# EAGLE design hw-demo02 (EAGLE 7.3.0)
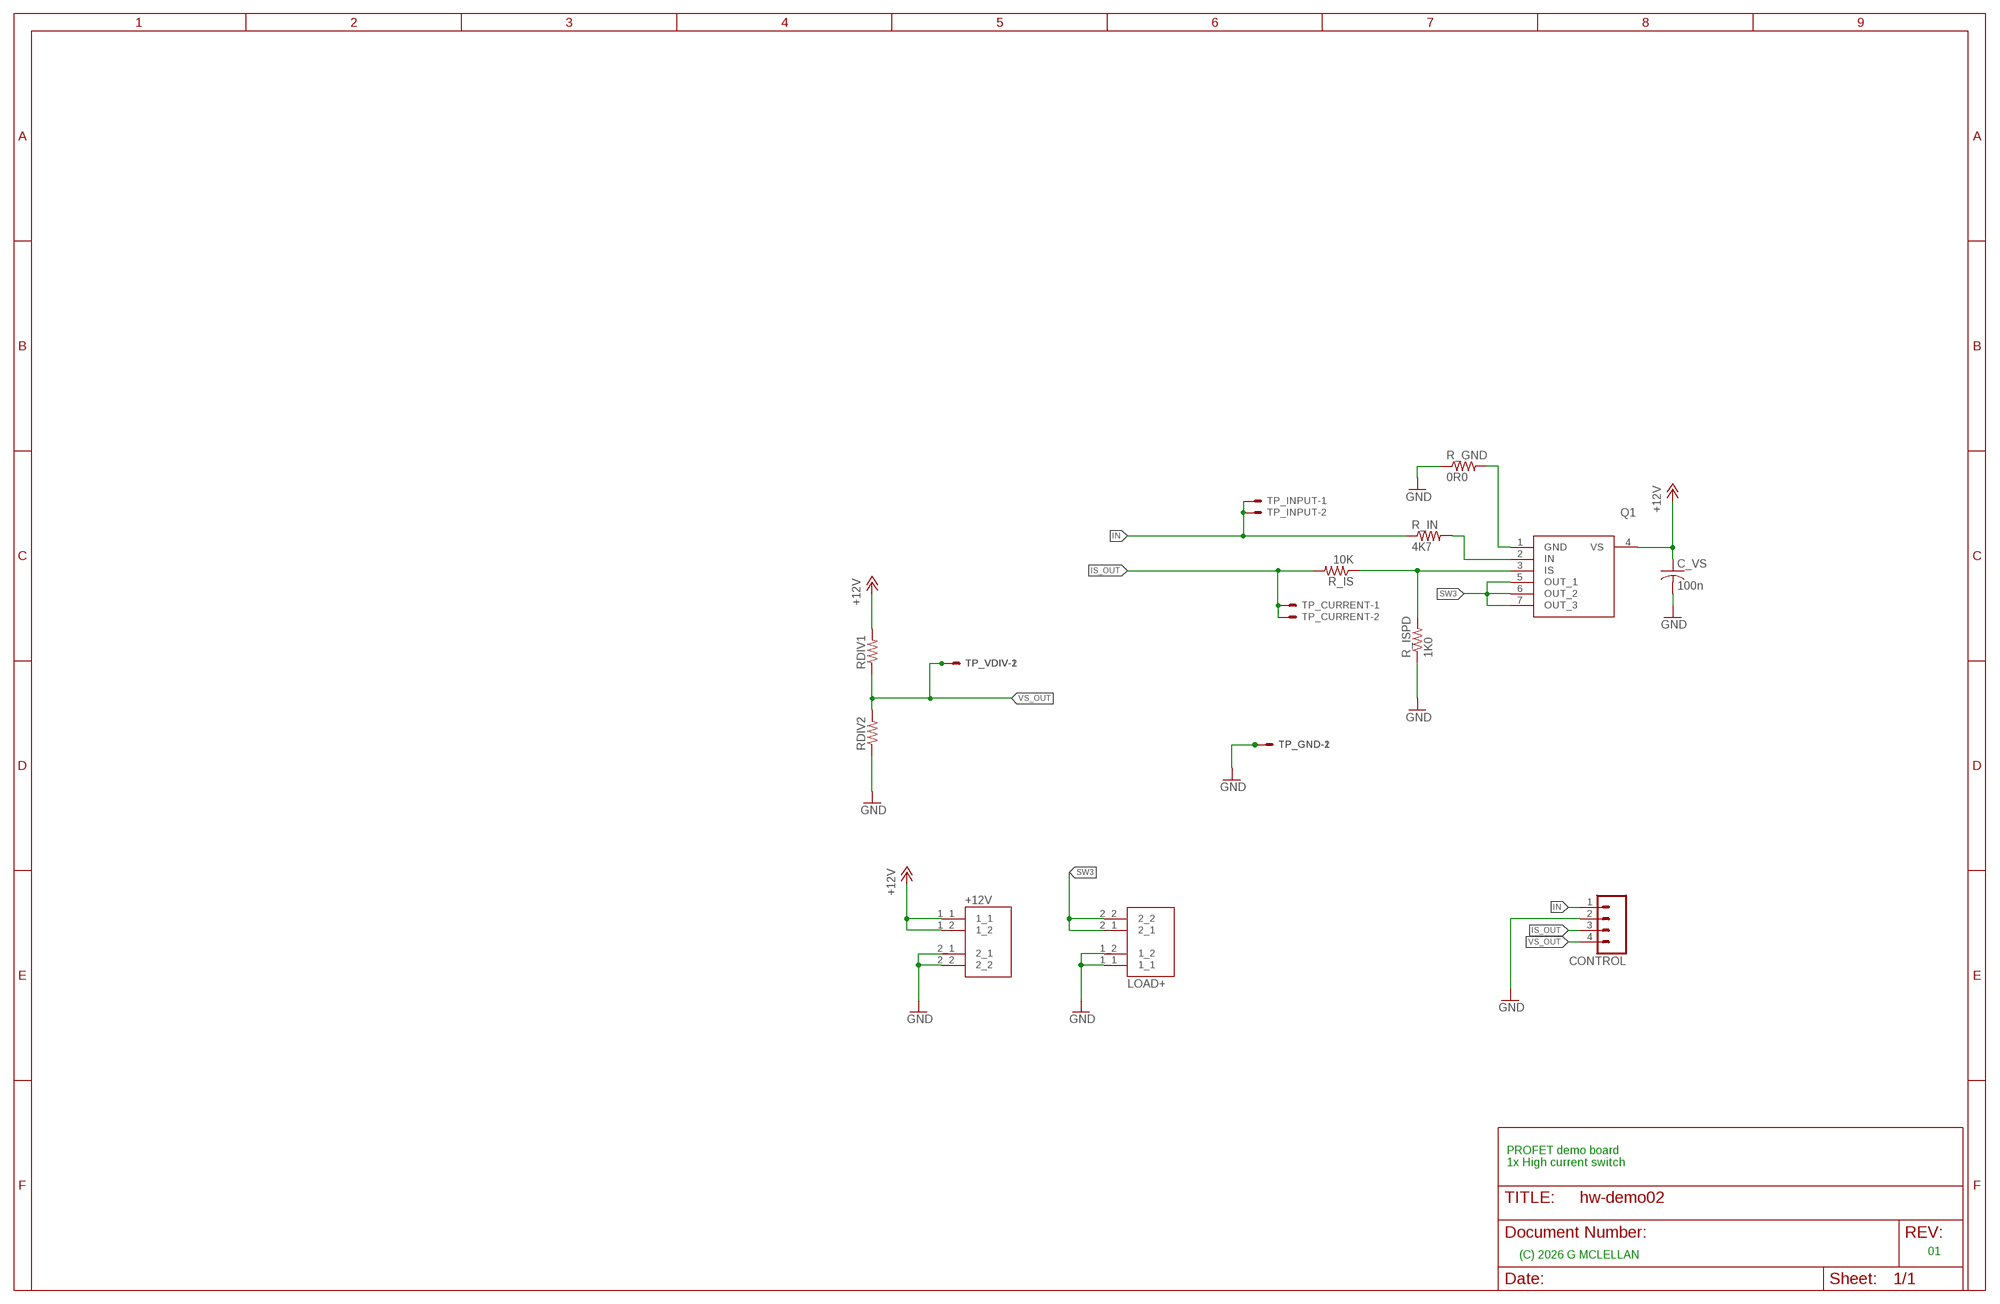
[diagram p0: schematic, sheet 1]

## Parts
+12V  VP0265840000G  [AMPHENOL_VP0265840000G]
C_VS  100n  C-USC0805K  [C0805K]
CONTROL  M04LOCK  [1X04_LOCK]
LOAD+  VP0265840000G  [AMPHENOL_VP0265840000G]
Q1  BTS500101TADATMA2  [BTS500101TADATMA2]
R_GND  0R0  R-US_R1206W  [R1206W]
R_IN  4K7  R-US_0207/12  [0207/12]
R_IS  10K  R-US_0207/12  [0207/12]
R_ISPD  1K0  R-US_0207/12  [0207/12]
RDIV1  R-US_R0805  [R0805]
RDIV2  R-US_R0805  [R0805]
TP_CURRENT  22-23-2021  [22-23-2021]
TP_GND  22-23-2021  [22-23-2021]
TP_INPUT  22-23-2021  [22-23-2021]
TP_VDIV  22-23-2021  [22-23-2021]

## Nets
+12V: +12V.1_1 +12V.1_2 C_VS.1 Q1.4(VS) RDIV1.2
CTL3`: Q1.2(IN) R_IN.2
GND: +12V.2_1 +12V.2_2 C_VS.2 CONTROL.2 LOAD+.1_1 LOAD+.1_2 R_GND.1 R_ISPD.1 RDIV2.1 TP_GND.1 TP_GND.2
IN: CONTROL.1 R_IN.1 TP_INPUT.1 TP_INPUT.2
IS: Q1.3(IS) R_IS.1 R_ISPD.2
IS_OUT: CONTROL.3 R_IS.2 TP_CURRENT.1 TP_CURRENT.2
N$3: Q1.1(GND) R_GND.2
SW3: LOAD+.2_1 LOAD+.2_2 Q1.5(OUT_1) Q1.6(OUT_2) Q1.7(OUT_3)
VS_OUT: CONTROL.4 RDIV1.1 RDIV2.2 TP_VDIV.1 TP_VDIV.2

## Notes on the sheet
- PROFET demo board
  1x High current switch
- 01
- (C) 2026 G MCLELLAN

## Library data of the parts
+12V LOAD+ = VP0265840000G:VP0265840000G; MANUFACTURER: Amphenol Anytek; MAXIMUM_PACKAGE_HEIGHT: 28.5mm; PARTREV: J; STANDARD: Manufacturer Recommendations
C_VS = rcl:C-US: CAPACITOR, American symbol
CONTROL = SparkFun-Connectors:M04: Header 4 Standard 4-pin 0.1" header. Use with straight break away headers (SKU : PRT-00116), right angle break away headers (PRT-00553), swiss pins (PRT-00743), machine pins (PRT-00117), and female headers (PRT-00115). Molex polarized connector foot print use with SKU : PRT-08231 with associated crimp pins and housings. 1MM SMD Version SKU: PRT-10208; PROD_ID: CONN-09696
Q1 = BTS500101TADATMA2:BTS500101TADATMA2: Power Switch ICs - Power Distribution MULTICHIP PROFET & GD Source: Datasheet <https://www.infineon.com/assets/row/public/packages/202/footprint_download/infineon-pg-to263-7-10-fpd-pdf-footprint-en.pdf>; DESCRIPTION: Power Switch ICs - Power Distribution MULTICHIP PROFET & GD; HEIGHT: 4.5mm; MANUFACTURER_NAME: Infineon; MANUFACTURER_PART_NUMBER: BTS500101TADATMA2; MOUSER_PART_NUMBER: 726-BTS500101TADATM2; MOUSER_PRICE-STOCK: https://www.mouser.co.uk/ProductDetail/Infineon-Technologies/BTS500101TADATMA2?qs=l7cgNqFNU1huaQviZWv9NQ%3D%3D
R_GND R_IN R_IS R_ISPD RDIV1 RDIV2 = rcl:R-US_: RESISTOR, American symbol
TP_CURRENT TP_GND TP_INPUT TP_VDIV = con-molex:22-23-2021: .100" (2.54mm) Center Header - 2 Pin; MF: MOLEX; MPN: 22-23-2021; OC_FARNELL: 1462926; OC_NEWARK: 25C3832

## Board
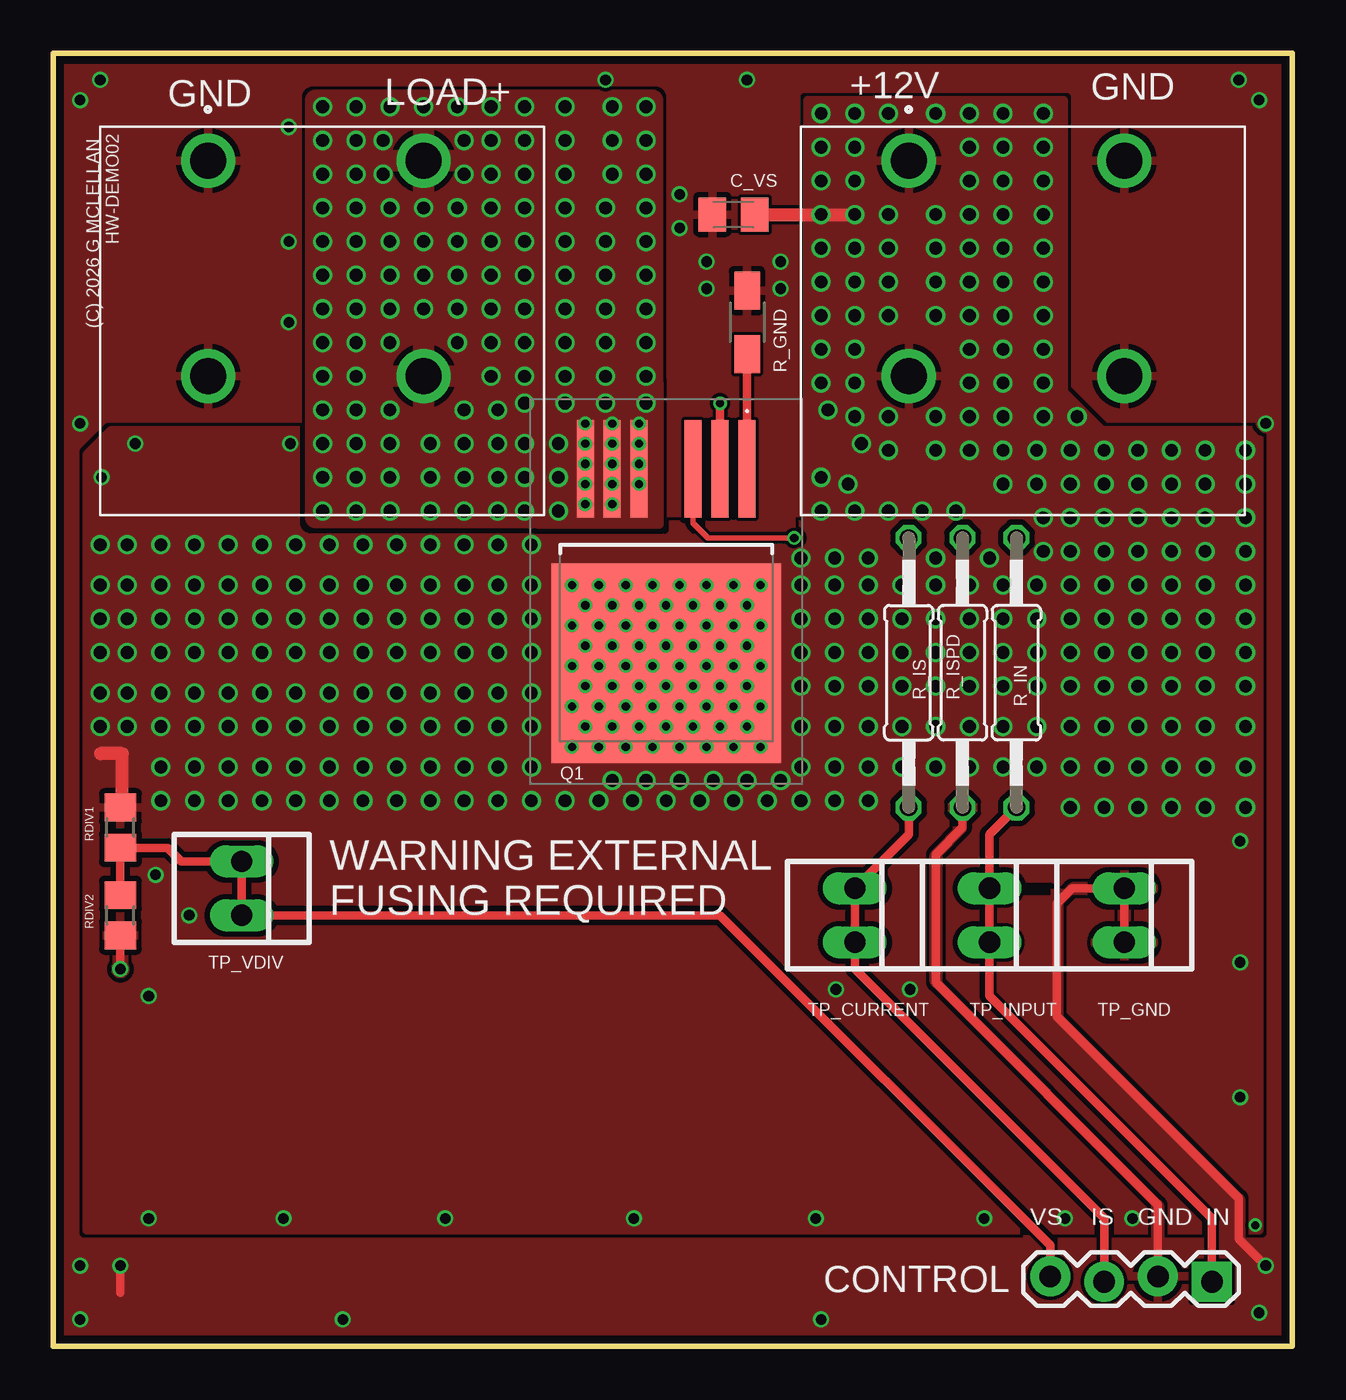
[diagram p1: board, top side]
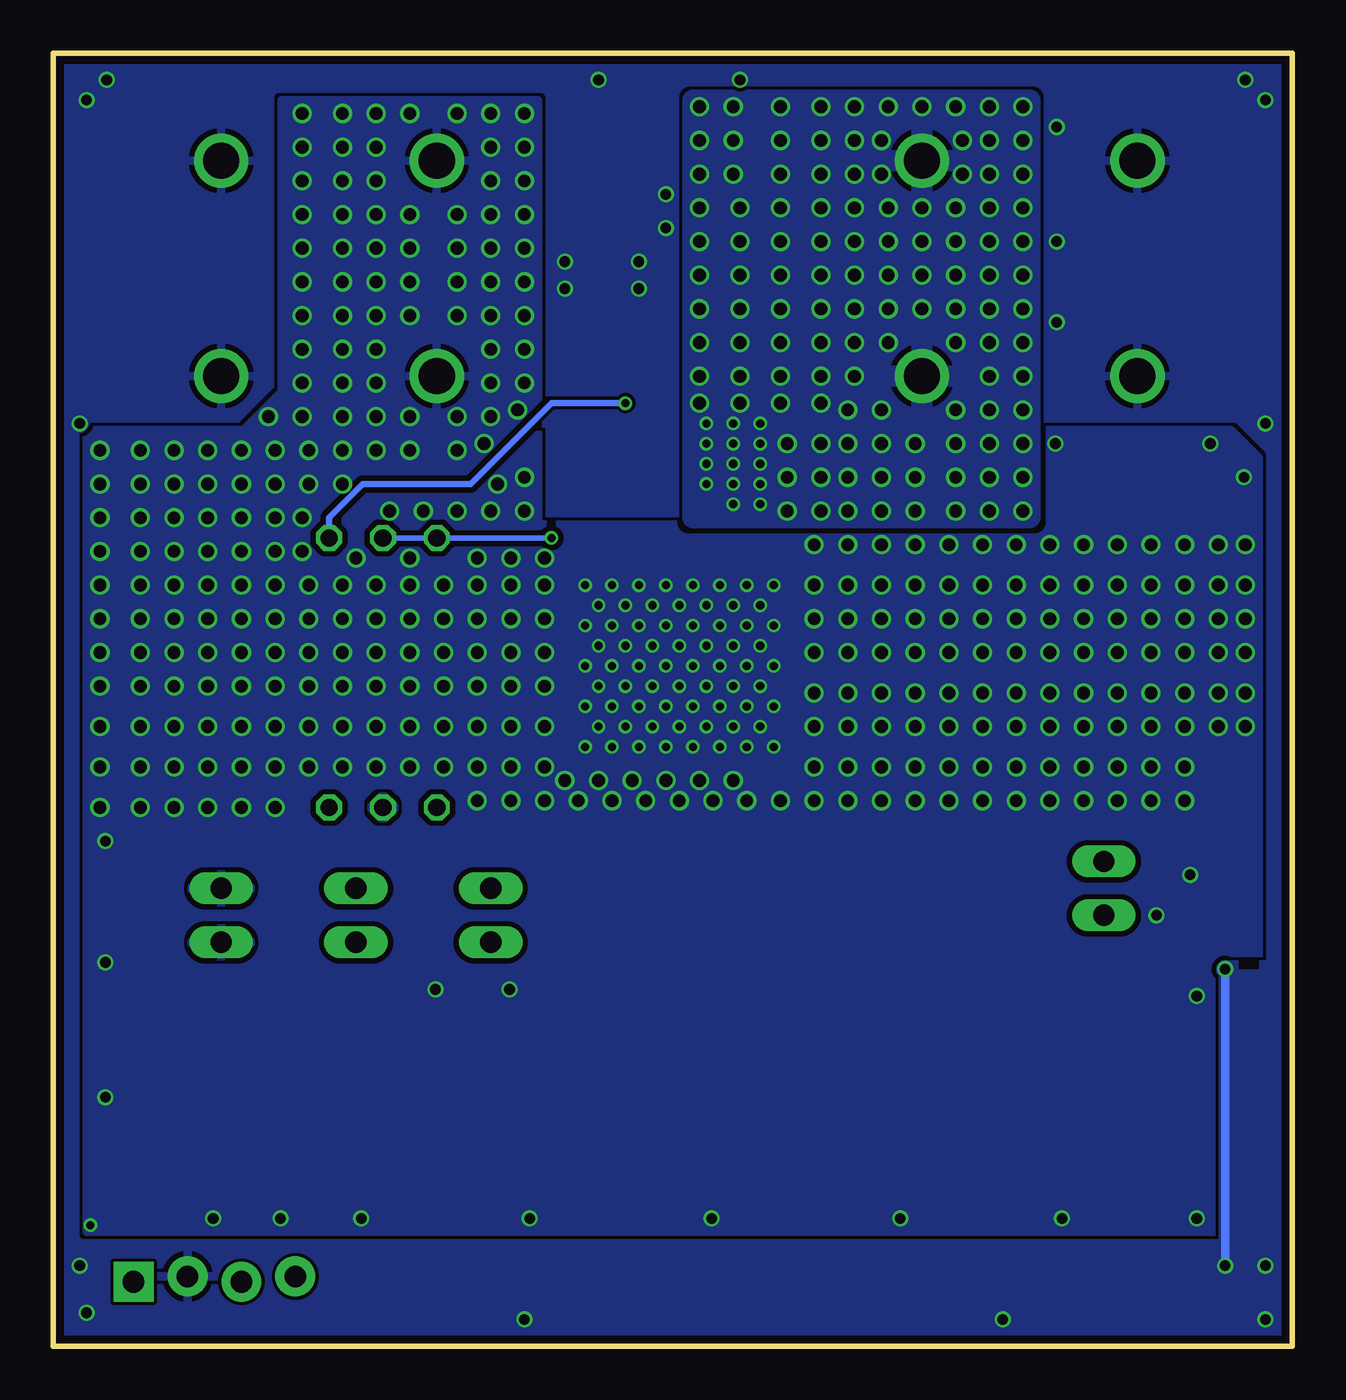
[diagram p2: board, bottom side, seen from below]

Size 58.41 x 60.95 mm. Coordinates in mm from the lower left corner, seen from the top.
Outline: 0,0 58.41,0 58.41,60.95 0,60.95 0,0
Copper layers (1*16): Top 0.035559375mm / dielectric 1.6mm / Bottom 0.035559375mm
Design rules "oshpark-2layer": minimum track width 6mil, minimum drill 10mil, track to track 6mil, track to pad 6mil, pad to pad 6mil, via to via 6mil, smd to smd 6mil, copper to edge 15mil, drill to drill 6mil, minimum pad ring 5mil, minimum via ring 5mil, stop-mask expansion 2.5mil, vias tented up to drill 0mil, thermal gap 10mil
tRestrict: area 46,21.3 to 47,21.6
bRestrict: area 1.6,17.8 to 2.5,18.1

### Footprints (pad centres in the part's own frame; a part is rotated, then mirrored left to right if it is on the bottom)
AMPHENOL_VP0265840000G = drill 1.7: 1_1 -5.08,5.08; 1_2 -5.08,-5.08; 2_1 5.08,5.08; 2_2 5.08,-5.08
C0805K = smd 1.3 x 1.6: 1 -1,0; 2 1,0
1X04_LOCK = drill 1.016 pad 1.88 square: 1 0,0.127 | drill 1.016 pad 1.88: 2 2.54,-0.127; 3 5.08,0.127; 4 7.62,-0.127
BTS500101TADATMA2 = smd 0.8 x 4.6: 1 -3.81,-6.425; 2 -2.54,-6.425; 3 -1.27,-6.425; 5 1.27,-6.425; 6 2.54,-6.425; 7 3.81,-6.425 | smd 10.8 x 9.4: 4 0,2.725
R1206W = smd 1.8 x 1.2: 1 -1.499,0; 2 1.499,0
0207/12 = drill 0.813 octagon: 1 -6.35,0; 2 6.35,0
R0805 = smd 1.3 x 1.5: 1 -0.95,0; 2 0.95,0
22-23-2021 = drill 1 long: 1 -1.27,0; 2 1.27,0

### Placement (x,y rotation side)
+12V  45.4,50.8 0 top
C_VS  32.07,53.34 180 top
CONTROL  54.61,3.17 180 top
LOAD+  12.38,50.8 0 top
Q1  28.89,34.92 180 top
R_GND  32.7,48.26 270 top
R_IN  45.4,31.75 90 top
R_IS  40.32,31.75 270 top
R_ISPD  42.86,31.75 90 top
RDIV1  3.17,24.45 90 top
RDIV2  3.17,20.32 90 top
TP_CURRENT  37.78,20.32 270 top
TP_GND  50.48,20.32 270 top
TP_INPUT  44.13,20.32 270 top
TP_VDIV  8.89,21.59 270 top

### Tracks (layer width: path | path; a pad name or v marks a point on that pad's centre or on a via)
+12V  (via drill 0.38, 0.5, 0.6)
  Top 0.305: RDIV1.2 3.26,25.72
  Top 0.61: 3.26,25.72 3.26,27.94 2.22,27.94 | C_VS.1 v37.78,53.34
  other vias: 24.45,28.26 25.08,29.21 25.72,28.26 26.35,29.21 26.99,28.26 27.62,29.21 28.26,28.26 28.89,29.21 29.53,28.26 30.16,29.21 30.8,28.26 31.43,29.21 32.07,28.26 32.7,29.21 33.34,28.26 24.45,30.16 25.72,30.16 26.99,30.16 28.26,30.16 29.53,30.16 30.8,30.16 32.07,30.16 33.34,30.16 25.08,31.11 26.35,31.11 27.62,31.11 28.89,31.11 30.16,31.11 31.43,31.11 32.7,31.11 24.45,32.07 25.08,33.02 25.72,32.07 26.35,33.02 26.99,32.07 27.62,33.02 28.26,32.07 28.89,33.02 29.53,32.07 30.8,32.07 32.07,32.07 30.16,33.02 31.43,33.02 32.7,33.02 33.34,32.07 4.51,6.03 4.51,16.51 43.88,6.03 47.69,6.03 50.86,6.03 56.65,5.71 40.39,16.83 36.89,16.83 4.83,22.23 6.41,20.32 2.29,40.96 3.87,42.55 11.18,42.55 55.94,23.81 55.94,18.1 55.94,11.75 35.94,6.03 27.37,6.03 18.48,6.03 10.86,6.03 44.77,58.1 43.18,58.1 43.18,58.1 41.59,58.1 36.2,58.1 37.78,58.1 39.37,58.1 36.2,56.52 36.2,54.93 36.2,53.34 36.2,51.75 36.2,50.16 36.2,48.58 36.2,46.99 36.2,45.4 44.77,56.52 43.18,56.52 37.78,56.52 37.78,54.93 39.37,53.34 44.77,53.34 44.77,54.93 44.77,51.75 44.77,50.16 44.77,48.58 44.77,46.99 44.77,45.4 44.77,43.81 44.77,42.23 44.77,40.64 43.18,54.93 43.18,53.34 43.18,51.75 43.18,50.16 43.18,48.58 43.18,46.99 43.18,45.4 43.18,43.81 43.18,42.23 37.78,45.4 37.78,46.99 37.78,48.58 37.78,50.16 37.78,51.75 39.37,51.75 39.37,50.16 41.59,50.16 41.59,51.75 41.59,53.34 41.59,48.58 39.37,48.58 37.78,43.81 39.37,43.81 41.59,43.81 41.59,42.23 39.37,42.23 39.37,39.37 37.78,39.37 36.2,39.37 40.96,39.37 42.55,39.37 46.67,39.05 46.36,40.64 46.36,42.23 47.94,42.23 47.94,40.64 47.94,39.05 49.53,42.23 49.53,40.64 49.53,39.05 36.2,40.96 51.12,42.23 51.12,40.64 51.12,39.05 52.71,39.05 52.71,40.64 52.71,42.23 54.29,42.23 54.29,40.64 54.29,39.05 56.2,42.23 56.2,40.64 56.2,39.05 56.2,37.47 56.2,35.88 56.2,34.29 56.2,32.7 56.2,31.11 56.2,29.21 56.2,27.3 56.2,25.4 54.29,37.47 52.71,37.47 51.12,37.47 49.53,37.47 47.94,37.47 46.67,37.47 54.29,35.88 52.71,35.88 51.12,35.88 49.53,35.88 47.94,35.88 46.36,35.88 54.29,34.29 52.71,34.29 51.12,34.29 49.53,34.29 47.94,34.29 46.36,34.29 54.29,32.7 52.71,32.7 51.12,32.7 49.53,32.7 47.94,32.7 46.36,32.7 54.29,31.11 52.71,31.11 51.12,31.11 49.53,31.11 47.94,31.11 46.36,31.11 44.77,31.11 44.77,32.7 44.77,34.29 44.77,35.88 43.18,31.11 43.18,32.7 43.18,34.29 43.18,35.88 41.59,35.88 41.59,34.29 41.59,32.7 41.59,31.11 40.01,35.88 40.01,34.29 40.01,32.7 40.01,31.11 38.42,35.88 38.42,34.29 38.42,32.7 38.42,31.11 36.83,35.88 36.83,34.29 36.83,32.7 36.83,31.11 35.24,35.88 35.24,34.29 35.24,32.7 35.24,31.11 35.24,29.21 36.83,29.21 38.42,29.21 40.01,29.21 41.59,29.21 43.18,29.21 44.77,29.21 46.36,29.21 47.94,29.21 49.53,29.21 51.12,29.21 52.71,29.21 54.29,29.21 54.29,27.3 52.71,27.3 51.12,27.3 49.53,27.3 47.94,27.3 46.36,27.3 44.77,27.3 43.18,27.3 41.59,27.3 40.01,27.3 38.42,27.3 36.83,27.3 35.24,27.3 36.83,37.15 38.42,37.15 41.59,37.15 44.13,37.15 35.24,37.15 37.47,40.64 38.1,42.55 36.51,44.13 35.24,25.72 36.83,25.72 38.42,25.72 33.66,25.72 32.07,25.72 30.48,25.72 28.89,25.72 27.3,25.72 25.72,25.72 24.13,25.72 22.54,25.72 22.54,27.3 22.54,29.21 22.54,30.8 22.54,32.7 22.54,34.29 22.54,35.88 22.54,37.78 20.95,37.78 20.95,35.88 20.95,34.29 20.95,32.7 20.95,30.8 20.95,29.21 20.95,27.3 20.95,25.72 19.37,27.3 19.37,29.21 19.37,30.8 19.37,32.7 19.37,34.29 19.37,35.88 19.37,37.78 19.37,25.72 17.78,25.72 17.78,27.3 17.78,29.21 17.78,30.8 17.78,32.7 17.78,34.29 17.78,35.88 17.78,37.78 16.19,37.78 16.19,35.88 16.19,34.29 16.19,32.7 16.19,30.8 16.19,29.21 16.19,27.3 16.19,25.72 47.94,25.4 49.53,25.4 51.12,25.4 52.71,25.4 54.29,25.4 14.61,37.78 13.02,37.78 11.43,37.78 9.84,37.78 8.26,37.78 6.67,37.78 5.08,37.78 3.49,37.78 2.22,37.78 14.61,35.88 13.02,35.88 11.43,35.88 9.84,35.88 8.26,35.88 6.67,35.88 5.08,35.88 3.49,35.88 2.22,35.88 14.61,34.29 13.02,34.29 11.43,34.29 9.84,34.29 8.26,34.29 6.67,34.29 5.08,34.29 3.49,34.29 2.22,34.29 14.61,32.7 13.02,32.7 11.43,32.7 9.84,32.7 8.26,32.7 6.67,32.7 5.08,32.7 3.49,32.7 2.22,32.7 14.61,30.8 13.02,30.8 11.43,30.8 9.84,30.8 8.26,30.8 6.67,30.8 5.08,30.8 3.49,30.8 2.22,30.8 14.61,29.21 13.02,29.21 11.43,29.21 9.84,29.21 8.26,29.21 6.67,29.21 5.08,29.21 3.49,29.21 2.22,29.21 14.61,27.3 13.02,27.3 11.43,27.3 9.84,27.3 8.26,27.3 6.67,27.3 5.08,27.3 14.61,25.72 13.02,25.72 11.43,25.72 9.84,25.72 8.26,25.72 6.67,25.72 5.08,25.72 24.45,33.97 25.72,33.97 26.99,33.97 28.26,33.97 29.53,33.97 30.8,33.97 32.07,33.97 33.34,33.97 32.7,34.92 31.43,34.92 30.16,34.92 28.89,34.92 27.62,34.92 26.35,34.92 25.08,34.92 24.45,35.88 25.72,35.88 26.99,35.88 28.26,35.88 29.53,35.88 30.8,35.88 32.07,35.88 33.34,35.88 26.35,26.67 27.94,26.67 29.53,26.67 31.11,26.67 32.7,26.67 34.29,26.67 46.67,58.1 46.67,56.52 46.67,54.93 46.67,53.34 46.67,51.75 46.67,50.16 46.67,48.58 46.67,46.99 46.67,45.4 46.67,43.81 48.26,43.81
  pour Top (isolate 0.254, rank 4): 47.62,58.74 47.62,44.98 49.42,43.18 56.83,43.18 56.83,5.46 1.59,5.46 1.59,42.04 2.73,43.18 12.38,43.18 12.38,38.73 35.56,38.73 35.56,58.74
  pour Bottom (isolate 0.254, rank 4): 56.83,5.4 56.83,43.18 49.42,43.18 47.62,44.98 47.62,58.74 35.56,58.74 35.56,38.73 12.38,38.73 12.38,43.18 2.9,43.18 1.59,41.87 1.59,5.4
  pour Top (no thermals): 22.86,38.1 35.24,38.1 35.24,26.35 22.86,26.35
CTL3`  (via drill 0.38)
  Top 0.406: v31.43,44.45 Q1.2
  Bottom 0.305: R_IN.2 45.4,39.05 43.82,40.64 38.73,40.64 34.93,44.45 v31.43,44.45
GND  (via drill 0.5)
  Top 0.406: CONTROL.2 52.07,6.67 41.59,17.14 41.59,23.18 42.86,24.45 R_ISPD.1 | RDIV2.1 v3.17,17.78 | v3.17,3.81 3.17,2.54 | v57.15,3.81 55.88,5.08 55.88,6.99 47.31,15.56 47.31,20.88 48.02,21.59 TP_GND.1 TP_GND.2
  Bottom 0.406: v3.17,17.78 v3.17,3.81
  other vias: 34.29,49.85 34.29,51.12 1.27,1.27 1.27,3.81 56.83,1.59 13.65,1.27 36.2,1.27 1.27,58.74 2.22,59.69 55.88,59.69 56.83,58.74 57.15,43.5 1.27,43.5 26.04,59.69 32.7,59.69 11.11,57.47 11.11,52.07 11.11,48.26 29.53,52.7 29.53,54.29 30.8,49.85 30.8,51.12
  pour Bottom (rank 6): 0,60.96 58.42,60.96 58.42,0 0,0
  pour Top (rank 6): 0,60.96 58.42,60.96 58.42,0 0,0
IN
  Top 0.406: CONTROL.1 54.61,6.03 44.13,16.51 TP_INPUT.2 TP_INPUT.1 44.13,24.13 R_IN.1
IS  (via drill 0.38)
  Top 0.254: Q1.3 30.16,38.81 30.87,38.1 v34.93,38.1
  Bottom 0.254: R_ISPD.2 R_IS.1 v34.93,38.1
IS_OUT
  Top 0.406: CONTROL.3 49.53,6.03 37.78,17.78 TP_CURRENT.2 TP_CURRENT.1 40.32,24.13 R_IS.2
N$3
  Top 0.406: Q1.1 R_GND.2
SW3  (via drill 0.38, 0.6)
  other vias: 12.7,39.37 14.29,39.37 23.81,39.37 22.22,39.37 19.37,39.37 15.88,39.37 17.78,39.37 12.7,40.96 14.29,40.96 15.88,40.96 17.78,40.96 19.37,40.96 22.22,40.96 23.81,40.96 23.81,42.55 24.13,44.45 26.04,44.45 27.94,44.45 27.94,45.72 27.94,47.31 27.94,48.9 27.94,50.48 27.94,52.07 27.94,53.66 27.94,58.42 12.7,42.55 12.7,44.13 12.7,45.72 12.7,47.31 12.7,48.9 12.7,50.48 12.7,52.07 12.7,53.66 12.7,58.42 12.7,56.83 12.7,55.24 27.94,56.83 27.94,55.24 14.29,58.42 15.88,58.42 17.46,58.42 26.35,58.42 24.13,58.42 22.22,58.42 19.05,58.42 20.64,58.42 14.29,56.83 15.56,56.83 19.37,56.83 20.64,56.83 22.22,56.83 24.13,56.83 26.35,56.83 14.29,55.24 15.56,55.24 19.37,55.24 20.64,55.24 22.22,55.24 24.13,55.24 26.35,55.24 14.29,53.66 15.88,53.66 17.46,53.66 19.05,53.66 20.64,53.66 22.22,53.66 24.13,53.66 26.04,53.66 14.29,52.07 15.88,52.07 17.46,52.07 19.05,52.07 20.64,52.07 22.22,52.07 24.13,52.07 26.04,52.07 14.29,50.48 15.88,50.48 17.46,50.48 19.05,50.48 20.64,50.48 22.22,50.48 24.13,50.48 26.04,50.48 14.29,48.9 15.88,48.9 17.46,48.9 19.05,48.9 20.64,48.9 22.22,48.9 24.13,48.9 26.04,48.9 14.29,47.31 15.88,47.31 19.05,47.31 20.64,47.31 22.22,47.31 24.13,47.31 26.04,47.31 14.29,45.72 20.64,45.72 22.22,45.72 24.13,45.72 26.04,45.72 14.29,44.13 15.88,44.13 19.37,44.13 22.22,44.45 14.29,42.55 15.88,42.55 17.78,42.55 19.37,42.55 22.22,42.55 20.95,39.37 20.95,40.96 20.95,42.55 20.95,44.13 25.08,39.69 25.08,40.64 25.08,41.59 25.08,42.55 25.08,43.5 26.35,43.5 26.35,42.55 26.35,41.59 26.35,40.64 26.35,39.69 27.62,40.64 27.62,41.59 27.62,42.55 27.62,43.5
  pour Top (rank 3): 12.38,58.74 28.26,58.74 28.26,39.05 12.38,39.05
  pour Bottom (rank 3): 12.38,58.74 28.26,58.74 28.26,39.05 12.38,39.05
  pour Top (no thermals): 23.81,38.73 28.57,38.73 28.57,45.4 22.86,45.4 22.86,38.73
VS_OUT
  Top 0.406: RDIV2.2 RDIV1.1 5.4,23.5 6.03,22.86 TP_VDIV.1 TP_VDIV.2 31.43,20.32 46.99,4.76 CONTROL.4

### Text on the board
tNames: GND | GND | (C) 2026 G MCLELLAN / HW-DEMO02 | WARNING EXTERNAL / FUSING REQUIRED | VS | IS | GND | IN